# Altium schematic sheet PSU.SchDoc
size 594 x 420 mm
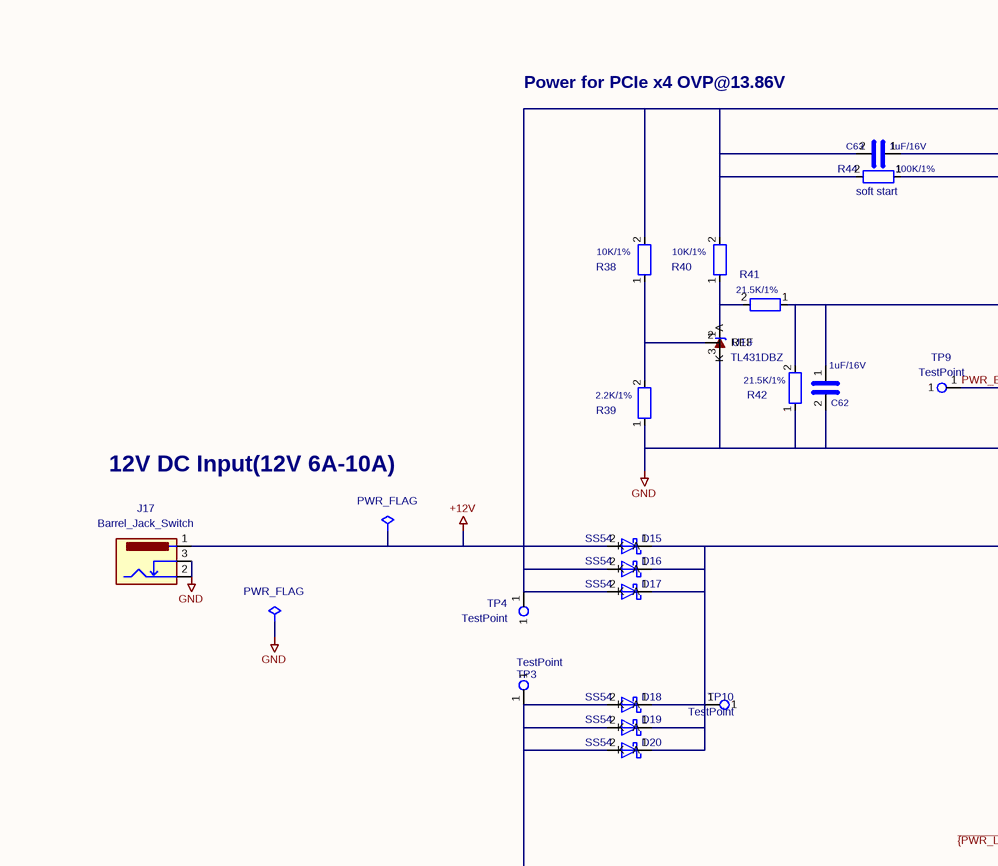
[diagram p0: PSU.SchDoc, top left]
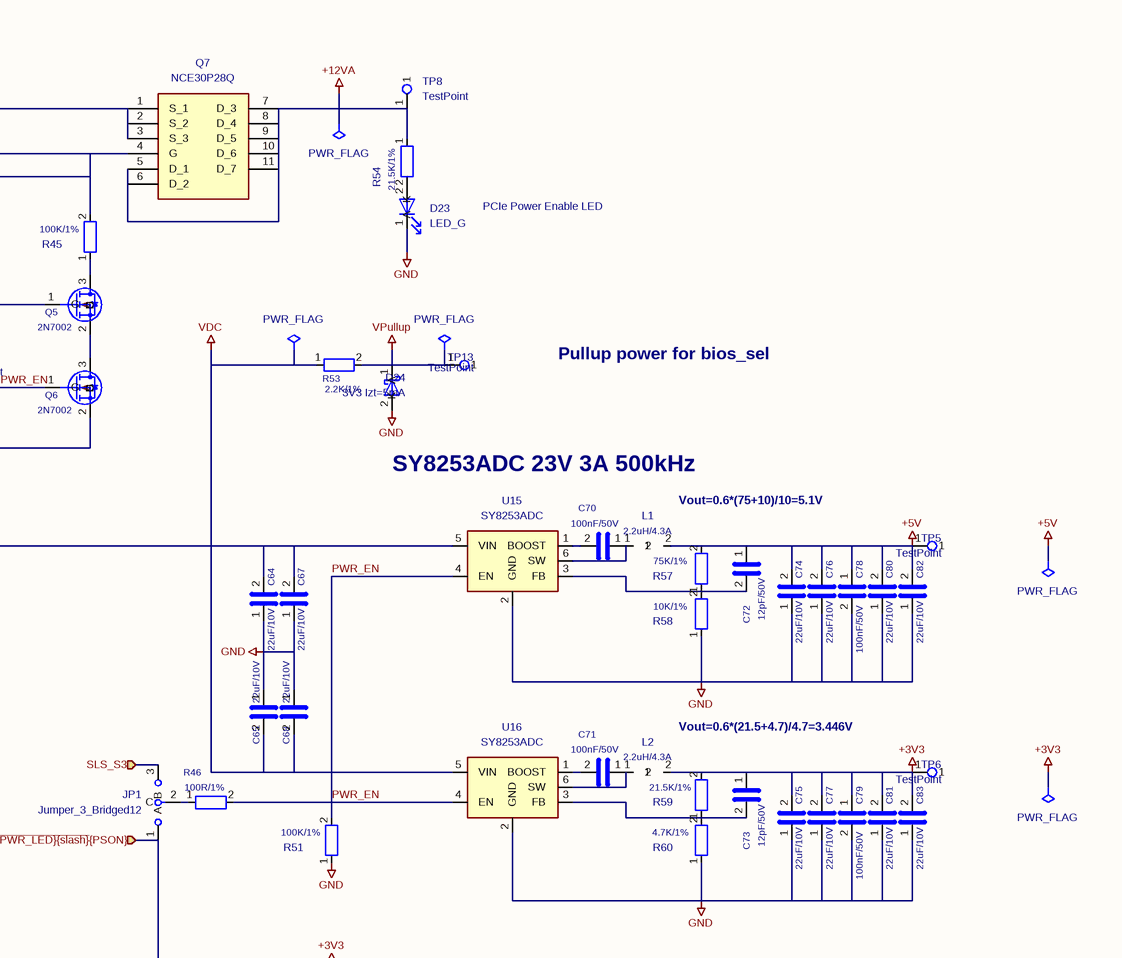
[diagram p1: PSU.SchDoc, top right]
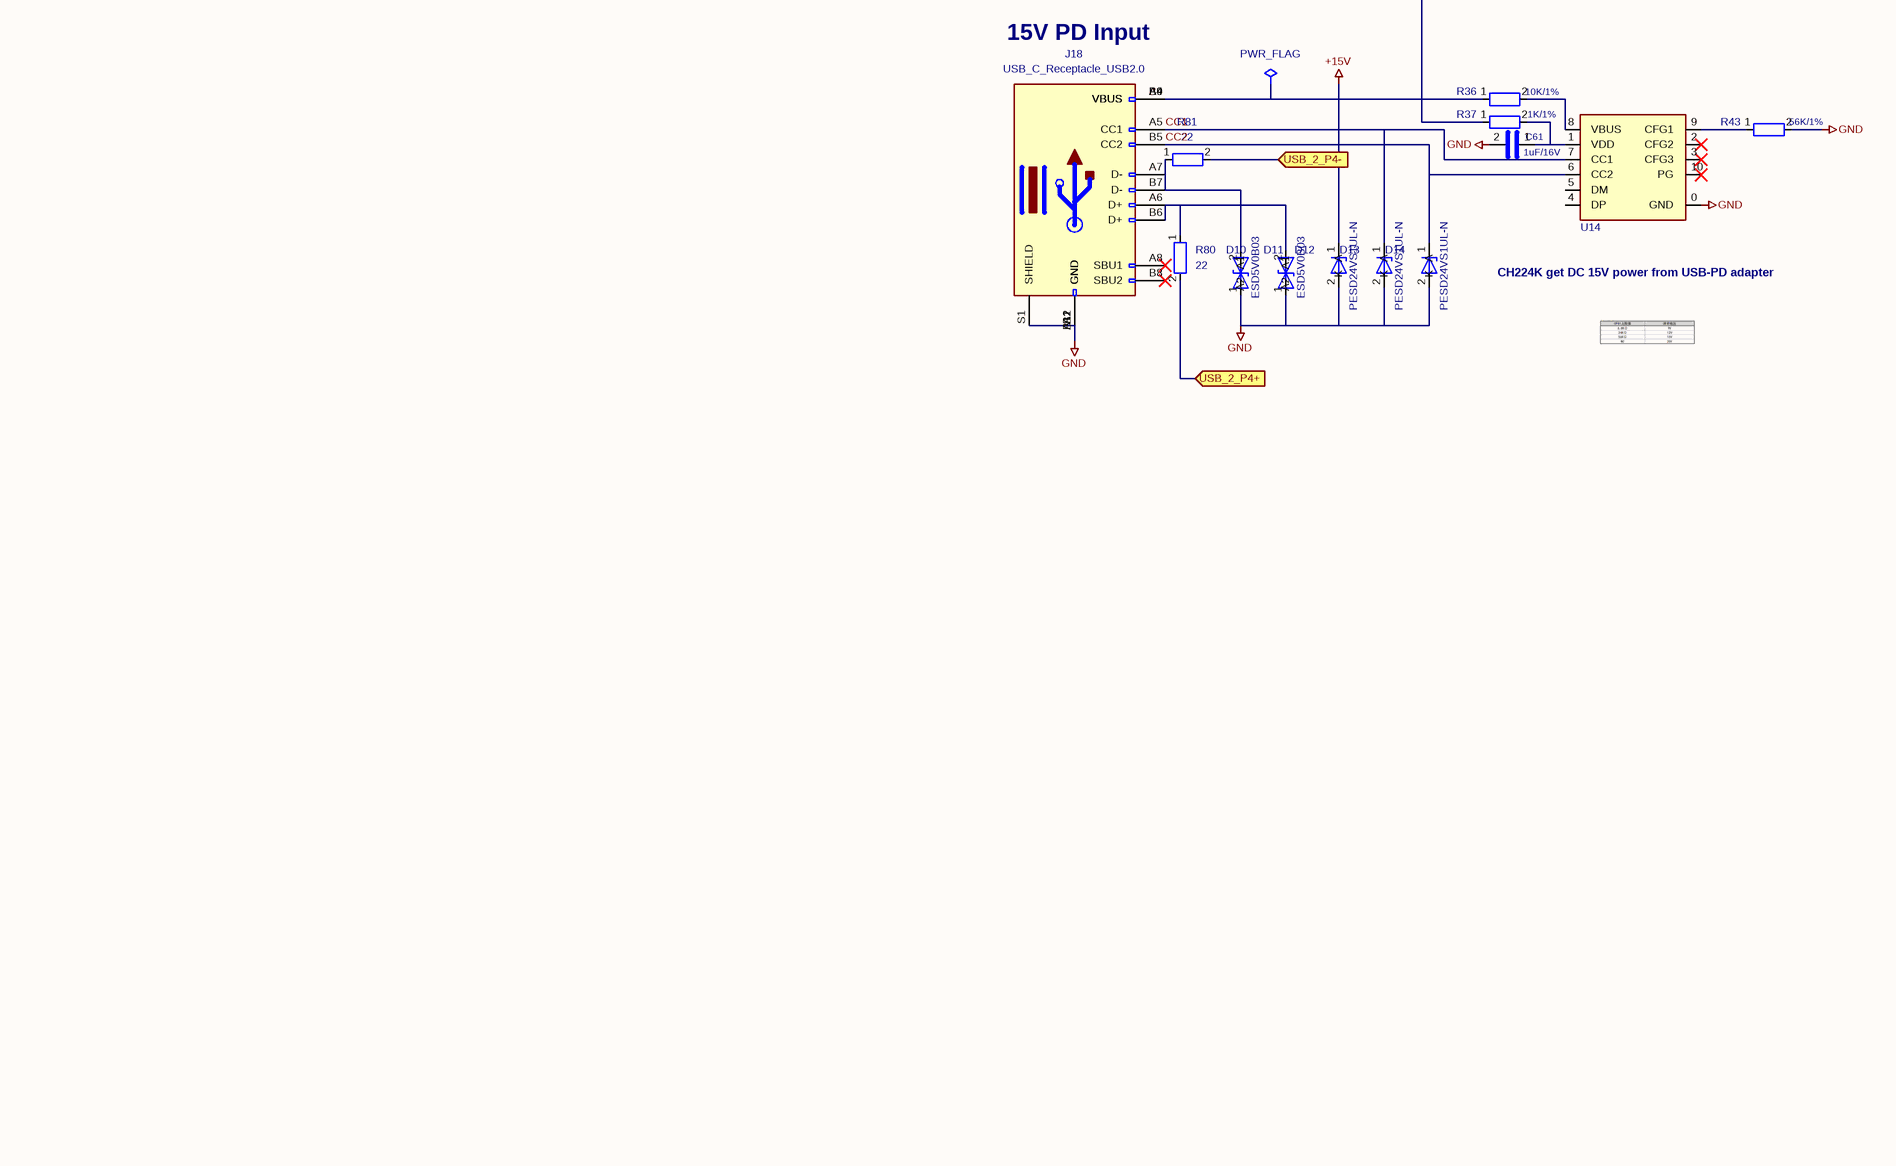
[diagram p2: PSU.SchDoc, bottom left]
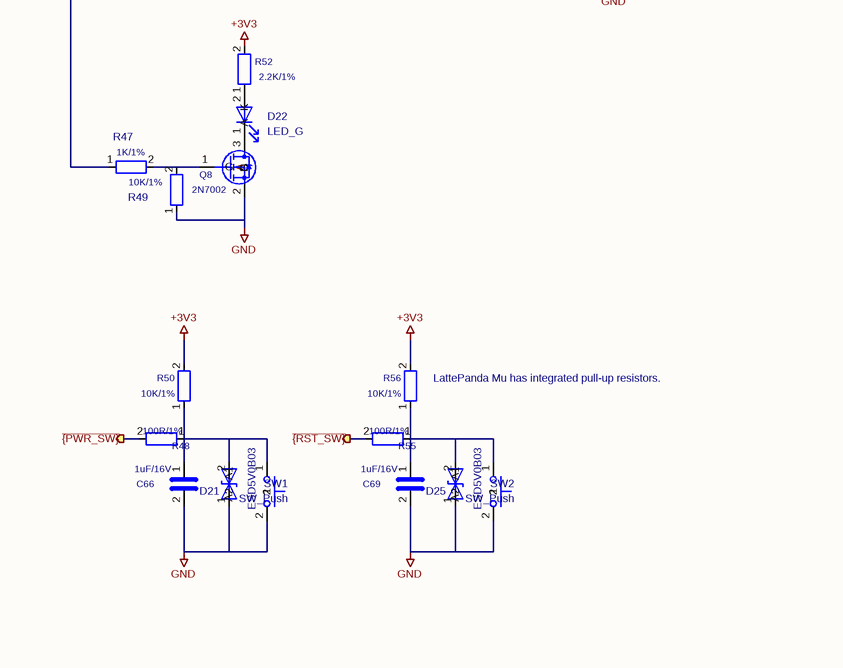
[diagram p3: PSU.SchDoc, bottom right]

## Parts
#FLG0901  PWR_FLAG  (graphical)
#FLG0902  PWR_FLAG  (graphical)
#FLG0903  PWR_FLAG  (graphical)
#FLG0904  PWR_FLAG  (graphical)
#FLG0905  PWR_FLAG  (graphical)
#FLG0906  PWR_FLAG  (graphical)
#FLG0907  PWR_FLAG  (graphical)
#FLG0908  PWR_FLAG  (graphical)
C61  1uF/16V  [C_0402_1005Metric]
C62  1uF/16V  [C_0402_1005Metric]
C63  1uF/16V  [C_0402_1005Metric]
C64  22uF/10V  [C_0603_1608Metric]
C65  22uF/10V  [C_0603_1608Metric]
C66  1uF/16V  [C_0402_1005Metric]
C67  22uF/10V  [C_0603_1608Metric]
C68  22uF/10V  [C_0603_1608Metric]
C69  1uF/16V  [C_0402_1005Metric]
C70  100nF/50V  [C_0402_1005Metric]
C71  100nF/50V  [C_0402_1005Metric]
C72  12pF/50V  [C_0402_1005Metric]
C73  12pF/50V  [C_0402_1005Metric]
C74  22uF/10V  [C_0603_1608Metric]
C75  22uF/10V  [C_0603_1608Metric]
C76  22uF/10V  [C_0603_1608Metric]
C77  22uF/10V  [C_0603_1608Metric]
C78  100nF/50V  [C_0402_1005Metric]
C79  100nF/50V  [C_0402_1005Metric]
C80  22uF/10V  [C_0603_1608Metric]
C81  22uF/10V  [C_0603_1608Metric]
C82  22uF/10V  [C_0603_1608Metric]
C83  22uF/10V  [C_0603_1608Metric]
D10  ESD5V0B03  [D_0402_1005Metric]
D11  ESD5V0B03  [D_0402_1005Metric]
D12  PESD24VS1UL-N  [D_0402_1005Metric]
D13  PESD24VS1UL-N  [D_0402_1005Metric]
D14  PESD24VS1UL-N  [D_0402_1005Metric]
D15  SS54  [D_SMA]
D16  SS54  [D_SMA]
D17  SS54  [D_SMA]
D18  SS54  [D_SMA]
D19  SS54  [D_SMA]
D20  SS54  [D_SMA]
D21  ESD5V0B03  [D_0402_1005Metric]
D22  LED_G  [LED_0603_1608Metric]
D23  LED_G  [LED_0603_1608Metric]
D24  3V3 Izt=5mA  [D_SOD-323]
D25  ESD5V0B03  [D_0402_1005Metric]
J17  Barrel_Jack_Switch  [DC_Jack_DC007B_30V_10A]
J18  USB_C_Receptacle_USB2.0  [USB_C_Receptacle_G-Switch_GT-USB-7010ASV]
JP1  Jumper_3_Bridged12  [PinHeader_1x03_P2.54mm_Vertical]
L1  2.2uH/4.3A  [L_Sunlord_SWPA4020S]
L2  2.2uH/4.3A  [L_Sunlord_SWPA4020S]
Q5  2N7002  [SOT-23]
Q6  2N7002  [SOT-23]
Q7  NCE30P28Q  [MOSFET_PDFN8_3.3x3.3]
Q8  2N7002  [SOT-23]
R36  10K/1%  [R_0402_1005Metric]
R37  1K/1%  [R_0402_1005Metric]
R38  10K/1%  [R_0402_1005Metric]
R39  2.2K/1%  [R_0402_1005Metric]
R40  10K/1%  [R_0402_1005Metric]
R41  21.5K/1%  [R_0402_1005Metric]
R42  21.5K/1%  [R_0402_1005Metric]
R43  56K/1%  [R_0402_1005Metric]
R44  100K/1%  [R_0402_1005Metric]
R45  100K/1%  [R_0402_1005Metric]
R46  100R/1%  [R_0402_1005Metric]
R47  1K/1%  [R_0402_1005Metric]
R48  100R/1%  [R_0402_1005Metric]
R49  10K/1%  [R_0402_1005Metric]
R50  10K/1%  [R_0402_1005Metric]
R51  100K/1%  [R_0402_1005Metric]
R52  2.2K/1%  [R_0402_1005Metric]
R53  2.2K/1%  [R_0402_1005Metric]
R54  21.5K/1%  [R_0402_1005Metric]
R55  100R/1%  [R_0402_1005Metric]
R56  10K/1%  [R_0402_1005Metric]
R57  75K/1%  [R_0402_1005Metric]
R58  10K/1%  [R_0402_1005Metric]
R59  21.5K/1%  [R_0402_1005Metric]
R60  4.7K/1%  [R_0402_1005Metric]
R80  22  [R_0402_1005Metric]
R81  22  [R_0402_1005Metric]
SW1  SW_Push  [SW_Push_6x6x6]
SW2  SW_Push  [SW_Push_6x6x6]
TP3  TestPoint  [TestPoint_Pad_D1.5mm]
TP4  TestPoint  [TestPoint_Pad_D1.5mm]
TP5  TestPoint  [TestPoint_Pad_D1.5mm]
TP6  TestPoint  [TestPoint_Pad_D1.5mm]
TP8  TestPoint  [TestPoint_Pad_D1.5mm]
TP9  TestPoint  [TestPoint_Pad_D1.5mm]
TP10  TestPoint  [TestPoint_Pad_D1.5mm]
TP13  TestPoint  [TestPoint_Pad_D1.5mm]
U13  TL431DBZ  [SOT-23]
U14  CH224K  [ESSOP-10-1EP_3.9x5mm_P1.0mm_EP3.2x2.3]  (value not drawn)
U15  SY8253ADC  [TSOT-23-6]
U16  SY8253ADC  [TSOT-23-6]

## Ports
SLS_S3 (in), USB_2_P4+ (in), USB_2_P4- (in), ~{{PWR_LED}{slash}}{PSON} (in), ~{{PWR_SW}} (out), ~{{RST_SW}} (out)

## Nets
+3V3: #FLG0902.1 C73.1 C75.2 C77.2 C79.1 C81.2 C83.2 L2.2 R50.2 R52.2 R56.2 R59.2 TP6.1
+5V: #FLG0901.1 C72.1 C74.2 C76.2 C78.1 C80.2 C82.2 L1.2 R57.2 TP5.1
+12V: #FLG0907.1 C63.2 D15.2(A) D16.2(A) D17.2(A) J17.1 Q7.1(S_1) Q7.2(S_2) Q7.3(S_3) R38.2 R40.2 R44.2 TP4.1
+12VA: #FLG0905.1 Q7.5(D_1) Q7.6(D_2) Q7.7(D_3) Q7.8(D_4) Q7.9(D_5) Q7.10(D_6) Q7.11(D_7) R54.1 TP8.1
+15V: #FLG0908.1 D12.1(K) D18.2(A) D19.2(A) D20.2(A) J18.A4(VBUS) J18.A9(VBUS) J18.B4(VBUS) J18.B9(VBUS) R36.1 R37.1 TP3.1
GND: #FLG0903.1 C61.2 C62.2 C64.1 C65.1 C66.2 C67.1 C68.1 C69.2 C74.1 C75.1 C76.1 C77.1 C78.2 C79.2 C80.1 C81.1 C82.1 C83.1 D10.1(A1) D11.1(A1) D12.2(A) D13.2(A) D14.2(A) D21.1(A1) D23.1(K) D24.2(A) D25.1(A1) J17.2 J17.3 J18.A1(GND) J18.A12(GND) J18.B1(GND) J18.B12(GND) J18.S1(SHIELD) Q6.2(S) Q8.2(S) R39.1 R42.1 R43.2 R49.1 R51.1 R58.1 R60.1 SW1.2 SW2.2 U13.3(A) U14.0(GND) U15.2(GND) U16.2(GND)
VDC: #FLG0904.1 C64.2 C65.2 C67.2 C68.2 D15.1(K) D16.1(K) D17.1(K) D18.1(K) D19.1(K) D20.1(K) R53.1 TP10.1 U15.5(VIN) U16.5(VIN)
VPullup: #FLG0906.1 D24.1(K) R53.2 TP13.1
CC1: D13.1(K) J18.A5(CC1) U14.7(CC1)
CC2: D14.1(K) J18.B5(CC2) U14.6(CC2)
PWR_EN: Q6.1(G) R46.2 R51.2 TP9.1 U15.4(EN) U16.4(EN)
SLS_S3: JP1.3(B) ; port SLS_S3
USB_2_P4+: R80.2 ; port USB_2_P4+
USB_2_P4-: R81.2 ; port USB_2_P4-
~{{PWR_LED}{slash}}{PSON}: JP1.1(A) R47.1 ; port ~{{PWR_LED}{slash}}{PSON}
~{{PWR_SW}}: R48.2 ; port ~{{PWR_SW}}
~{{RST_SW}}: R55.2 ; port ~{{RST_SW}}
NetC61_1: C61.1 R37.2 U14.1(VDD)
NetC62_1: C62.1 Q5.1(G) R41.1 R42.2
NetC63_1: C63.1 Q7.4(G) R44.1 R45.2
NetC66_1: C66.1 D21.2(A2) R48.1 R50.1 SW1.1
NetC69_1: C69.1 D25.2(A2) R55.1 R56.1 SW2.1
NetC70_1: C70.1 L1.1 U15.6(SW)
NetC70_2: C70.2 U15.1(BOOST)
NetC71_1: C71.1 L2.1 U16.6(SW)
NetC71_2: C71.2 U16.1(BOOST)
NetC72_2: C72.2 R57.1 R58.2 U15.3(FB)
NetC73_2: C73.2 R59.1 R60.2 U16.3(FB)
NetD10_2: D10.2(A2) J18.A7(D-) J18.B7(D-) R81.1
NetD11_2: D11.2(A2) J18.A6(D+) J18.B6(D+) R80.1
NetD22_1: D22.1(K) Q8.3(D)
NetD22_2: D22.2(A) R52.1
NetD23_2: D23.2(A) R54.2
NetJP1_2: JP1.2(C) R46.1
NetQ5_2: Q5.2(S) Q6.3(D)
NetQ5_3: Q5.3(D) R45.1
NetQ8_1: Q8.1(G) R47.2 R49.2
NetR36_2: R36.2 U14.8(VBUS)
NetR38_1: R38.1 R39.2 U13.2(REF)
NetR40_1: R40.1 R41.2 U13.1(K)
NetR43_1: R43.1 U14.9(CFG1)

Not connected (* = marked no-connect by the designer): J18 A8(SBU1)* B8(SBU2)*; U14 2(CFG2)* 3(CFG3)* 4(DP) 5(DM) 10(PG)*

## Notes on the sheet
- Power for PCIe x4 OVP@13.86V
- (near R44) soft start
- PCIe Power Enable LED
- Pullup power for bios_sel
- 12V DC Input(12V 6A-10A)
- SY8253ADC 23V 3A 500kHz
- Vout=0.6*(75+10)/10=5.1V
- Vout=0.6*(21.5+4.7)/4.7=3.446V
- (near J18) 15V PD Input
- CH224K get DC 15V power from USB-PD adapter
- (near R56) LattePanda Mu has integrated pull-up resistors.
- 1
- 2
- 3
- 4
- 5
- 6
- 7
- 8
- 9
- 10
- 11
- A
- B
- C
- D
- E
- F
- G
- H
- Title: Primer Carrier for LattePanda Mu
- File: PSU.kicad_sch
- Sheet: /
- DFRobot
- KiCad E.D.A.  kicad (5.1.4)-1
- Size: A2
- Date: 2024-03-13
- Rev: V1.0.0
- Id: 1/1

## Library data of the parts
#FLG0901 #FLG0902 #FLG0903 #FLG0904 #FLG0905 #FLG0906 #FLG0907 #FLG0908 = PWR_FLAG: Description: Special symbol for telling ERC where power comes from; Value: PWR_FLAG
C61-C63 C66 C69-C73 C78 C79 = C: SCH_Show_Footprint: C0402
  C61-C63 C66 C69: Value: 1uF/16V; Footprint: A_HDJ_Library:C_0402_1005Metric
  C70 C71 C78 C79: Value: 100nF/50V; Footprint: A_HDJ_Library:C_0402_1005Metric
  C72 C73: Value: 12pF/50V; Footprint: Capacitor_SMD:C_0402_1005Metric
C64 C65 C67 C68 C74-C77 C80-C83 = C: SCH_Show_Footprint: C603; Value: 22uF/10V; Footprint: A_HDJ_Library:C_0603_1608Metric
D10 D11 D21 D25 = ESD9B5.0ST5G: SCH_Show_Footprint: D0402; Value: ESD5V0B03; Footprint: A_HDJ_Library:D_0402_1005Metric
D12-D14 = D_Zener: SCH_Show_Footprint: D0402; Value: PESD24VS1UL-N; Footprint: A_HDJ_Library:D_0402_1005Metric
D15-D20 = D_Schottky: SCH_Show_Footprint: SMA; Value: SS54; Footprint: A_HDJ_Library:D_SMA
D22 D23 = LED: SCH_Show_Footprint: LED0603; Value: LED_G; Footprint: A_HDJ_Library:LED_0603_1608Metric
D24 = D_Schottky: Description: Schottky diode; Value: 3V3 Izt=5mA; Footprint: A_HDJ_Library:D_SOD-323
J18 = USB_C_Receptacle_USB2.0_16P: Value: USB_C_Receptacle_USB2.0; Footprint: A_HDJ_Library:USB_C_Receptacle_G-Switch_GT-USB-7010ASV
L1 L2 = L: Value: 2.2uH/4.3A; Footprint: A_HDJ_Library:L_Sunlord_SWPA4020S
Q7 = AON7262E: Value: NCE30P28Q; Footprint: A_HDJ_Library:MOSFET_PDFN8_3.3x3.3
R36-R60 = R
  R36 R38 R40 R49 R58: Value: 10K/1%; Footprint: A_HDJ_Library:R_0402_1005Metric
  R37 R47: Value: 1K/1%; Footprint: A_HDJ_Library:R_0402_1005Metric
  R39 R52 R53: Value: 2.2K/1%; Footprint: A_HDJ_Library:R_0402_1005Metric
  R41 R42 R54 R59: Value: 21.5K/1%; Footprint: A_HDJ_Library:R_0402_1005Metric
  R43: Value: 56K/1%; Footprint: A_HDJ_Library:R_0402_1005Metric
  R44 R45 R51: Value: 100K/1%; Footprint: A_HDJ_Library:R_0402_1005Metric
  R46 R48 R55: Value: 100R/1%; Footprint: A_HDJ_Library:R_0402_1005Metric
  R50 R56: Value: 10K/1%; Footprint: Resistor_SMD:R_0402_1005Metric
  R57: Value: 75K/1%; Footprint: A_HDJ_Library:R_0402_1005Metric
  R60: Value: 4.7K/1%; Footprint: A_HDJ_Library:R_0402_1005Metric
R80 R81 = R: Description: Resistor; Value: 22; Footprint: Resistor_SMD:R_0402_1005Metric
U15 U16 = LM2734X: Value: SY8253ADC; Footprint: A_HDJ_Library:TSOT-23-6
J17 = Barrel_Jack_Switch: Value: Barrel_Jack_Switch; Footprint: A_HDJ_Library:DC_Jack_DC007B_30V_10A
JP1 = Jumper_3_Bridged12: Value: Jumper_3_Bridged12; Footprint: A_HDJ_Library:PinHeader_1x03_P2.54mm_Vertical
Q5 Q6 Q8 = 2N7002: Value: 2N7002; Footprint: A_HDJ_Library:SOT-23
SW1 SW2 = SW_Push: Value: SW_Push; Footprint: A_HDJ_Library:SW_Push_6x6x6
TP3-TP6 TP8-TP10 TP13 = TestPoint: Description: test point; Value: TestPoint; Footprint: A_HDJ_Library:TestPoint_Pad_D1.5mm
U13 = TL431DBZ: Value: TL431DBZ; Footprint: A_HDJ_Library:SOT-23
U14 = CH224K: Value: CH224K; Footprint: A_HDJ_Library:ESSOP-10-1EP_3.9x5mm_P1.0mm_EP3.2x2.3